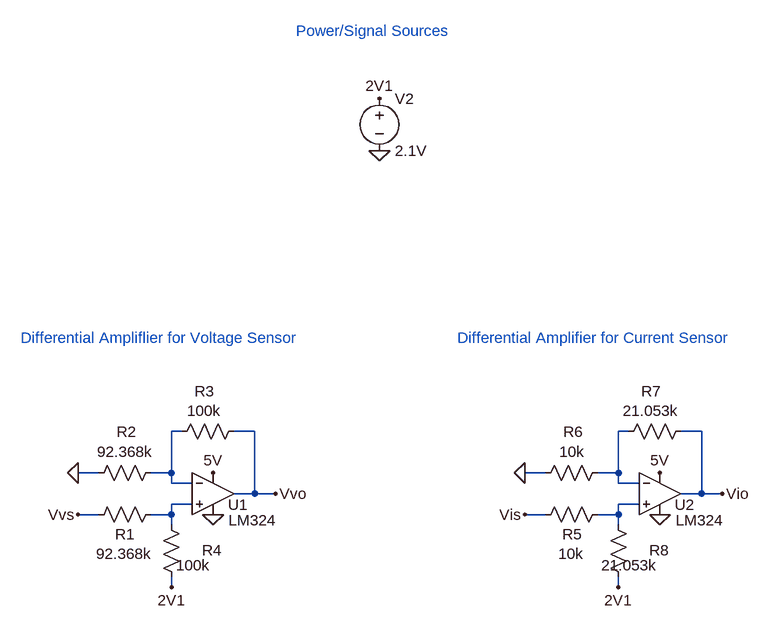
[diagram p0: schematic LevelShiftingAmplificationCircuit.asc]
LevelShiftingAmplificationCircuit.asc, the LTspice schematic file:
Version 4
SHEET 1 1012 680
WIRE -320 -96 -336 -96
WIRE -208 -96 -240 -96
WIRE 368 -96 352 -96
WIRE 480 -96 448 -96
WIRE -448 -32 -480 -32
WIRE -336 -32 -336 -96
WIRE -336 -32 -368 -32
WIRE 240 -32 208 -32
WIRE 352 -32 352 -96
WIRE 352 -32 320 -32
WIRE -336 -16 -336 -32
WIRE -304 -16 -336 -16
WIRE 352 -16 352 -32
WIRE 384 -16 352 -16
WIRE -208 0 -208 -96
WIRE -208 0 -240 0
WIRE -176 0 -208 0
WIRE 480 0 480 -96
WIRE 480 0 448 0
WIRE 512 0 480 0
WIRE -304 16 -336 16
WIRE 384 16 352 16
WIRE -448 32 -480 32
WIRE -336 32 -336 16
WIRE -336 32 -368 32
WIRE 240 32 208 32
WIRE 352 32 352 16
WIRE 352 32 320 32
WIRE -336 48 -336 32
WIRE 352 48 352 32
WIRE -336 144 -336 128
WIRE 352 144 352 128
FLAG -272 32 0
FLAG -272 -32 5V
FLAG -480 32 Vvs
FLAG -480 -32 0
FLAG -176 0 Vvo
FLAG -336 144 2V1
FLAG -16 -528 0
FLAG -16 -608 2V1
FLAG 416 32 0
FLAG 416 -32 5V
FLAG 208 32 Vis
FLAG 208 -32 0
FLAG 512 0 Vio
FLAG 352 144 2V1
SYMBOL Opamps/opamp2 -272 -64 R0
WINDOW 0 23 81 Left 2
WINDOW 3 24 105 Left 2
SYMATTR InstName U1
SYMATTR Value LM324
SYMBOL res -352 16 R90
WINDOW 0 62 55 VBottom 2
WINDOW 3 61 57 VTop 2
SYMATTR InstName R1
SYMATTR Value 92.368k
SYMBOL res -352 -48 R90
WINDOW 0 -32 53 VBottom 2
WINDOW 3 -32 55 VTop 2
SYMATTR InstName R2
SYMATTR Value 92.368k
SYMBOL res -224 -112 R90
WINDOW 0 -30 61 VBottom 2
WINDOW 3 -31 62 VTop 2
SYMATTR InstName R3
SYMATTR Value 100k
SYMBOL res -320 144 R180
WINDOW 0 -62 57 Left 2
WINDOW 3 -44 34 Left 2
SYMATTR InstName R4
SYMATTR Value 100k
SYMBOL voltage -16 -624 R0
SYMATTR InstName V2
SYMATTR Value 2.1V
SYMBOL Opamps/opamp2 416 -64 R0
WINDOW 0 23 81 Left 2
WINDOW 3 24 105 Left 2
SYMATTR InstName U2
SYMATTR Value LM324
SYMBOL res 336 16 R90
WINDOW 0 62 55 VBottom 2
WINDOW 3 61 57 VTop 2
SYMATTR InstName R5
SYMATTR Value 10k
SYMBOL res 336 -48 R90
WINDOW 0 -32 53 VBottom 2
WINDOW 3 -32 55 VTop 2
SYMATTR InstName R6
SYMATTR Value 10k
SYMBOL res 464 -112 R90
WINDOW 0 -30 61 VBottom 2
WINDOW 3 -31 62 VTop 2
SYMATTR InstName R7
SYMATTR Value 21.053k
SYMBOL res 368 144 R180
WINDOW 0 -62 57 Left 2
WINDOW 3 -44 34 Left 2
SYMATTR InstName R8
SYMATTR Value 21.053k
TEXT -568 -240 Left 2 ;Differential Ampliflier for Voltage Sensor
TEXT -144 -712 Left 2 ;Power/Signal Sources
TEXT 104 -240 Left 2 ;Differential Amplifier for Current Sensor

The netlist it stands for:
* LevelShiftingAmplificationCircuit.asc
XU1 N003 N001 5V 0 Vvo LM324  ; pins In+ In- V+ V- OUT
R1 N003 Vvs 92.368k
R2 N001 0 92.368k
R3 Vvo N001 100k
R4 2V1 N003 100k
V2 2V1 0 2.1V
XU2 N004 N002 5V 0 Vio LM324  ; pins In+ In- V+ V- OUT
R5 N004 Vis 10k
R6 N002 0 10k
R7 Vio N002 21.053k
R8 2V1 N004 21.053k
* Differential Ampliflier for Voltage Sensor
* Power/Signal Sources
* Differential Amplifier for Current Sensor
.backanno
.end